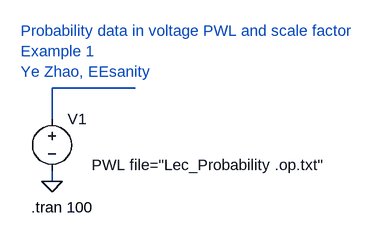
[diagram p0: schematic LTspice 07-2 Probability and PWL voltage_ex1.asc]
LTspice 07-2 Probability and PWL voltage_ex1.asc, the LTspice schematic file:
Version 4
SHEET 1 880 680
WIRE 192 80 64 80
WIRE 64 128 64 80
WIRE 64 224 64 208
FLAG 64 224 0
SYMBOL voltage 64 112 R0
WINDOW 123 0 0 Left 2
WINDOW 39 0 0 Left 2
WINDOW 3 61 87 Left 2
SYMATTR Value PWL file="Lec_Probability .op.txt"
SYMATTR InstName V1
TEXT 32 264 Left 2 !.tran 100
TEXT 16 -8 Left 2 ;Probability data in voltage PWL and scale factor\nExample 1\nYe Zhao, EEsanity

The netlist it stands for:
* LTspice 07-2 Probability and PWL voltage_ex1.asc
V1 N001 0 PWL file="Lec_Probability .op.txt"
.tran 100
* Probability data in voltage PWL and scale factor
* Example 1
* Ye Zhao, EEsanity
.backanno
.end